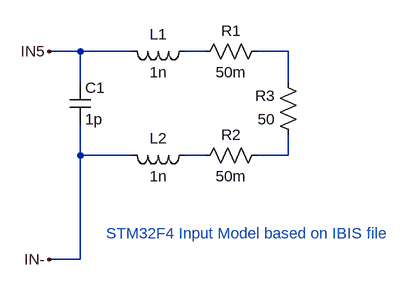
[diagram p0: schematic stm32-input-model.asc]
stm32-input-model.asc, the LTspice schematic file:
Version 4
SHEET 1 880 680
WIRE 128 80 80 80
WIRE 208 80 128 80
WIRE 320 80 288 80
WIRE 448 80 400 80
WIRE 128 128 128 80
WIRE 448 128 448 80
WIRE 128 240 128 192
WIRE 208 240 128 240
WIRE 320 240 288 240
WIRE 448 240 448 208
WIRE 448 240 400 240
WIRE 128 400 128 240
WIRE 128 400 80 400
FLAG 80 400 IN-
FLAG 80 80 IN5
SYMBOL cap 112 128 R0
SYMATTR InstName C1
SYMATTR Value 1p
SYMBOL ind 304 64 R90
WINDOW 0 5 56 VBottom 2
WINDOW 3 32 56 VTop 2
SYMATTR InstName L1
SYMATTR Value 1n
SYMBOL ind 304 224 R90
WINDOW 0 5 56 VBottom 2
WINDOW 3 32 56 VTop 2
SYMATTR InstName L2
SYMATTR Value 1n
SYMBOL res 416 64 R90
WINDOW 0 0 56 VBottom 2
WINDOW 3 32 56 VTop 2
SYMATTR InstName R1
SYMATTR Value 50m
SYMBOL res 416 224 R90
WINDOW 0 0 56 VBottom 2
WINDOW 3 32 56 VTop 2
SYMATTR InstName R2
SYMATTR Value 50m
SYMBOL res 464 224 R180
WINDOW 0 36 76 Left 2
WINDOW 3 36 40 Left 2
SYMATTR InstName R3
SYMATTR Value 50
TEXT 168 360 Left 2 ;STM32F4 Input Model based on IBIS file

The netlist it stands for:
* stm32-input-model.asc
C1 IN5 IN- 1p
L1 N001 IN5 1n
L2 N003 IN- 1n
R1 N002 N001 50m
R2 N004 N003 50m
R3 N004 N002 50
* STM32F4 Input Model based on IBIS file
.backanno
.end